# EAGLE design ArduinoWeatherStation (EAGLE 9.4.2)
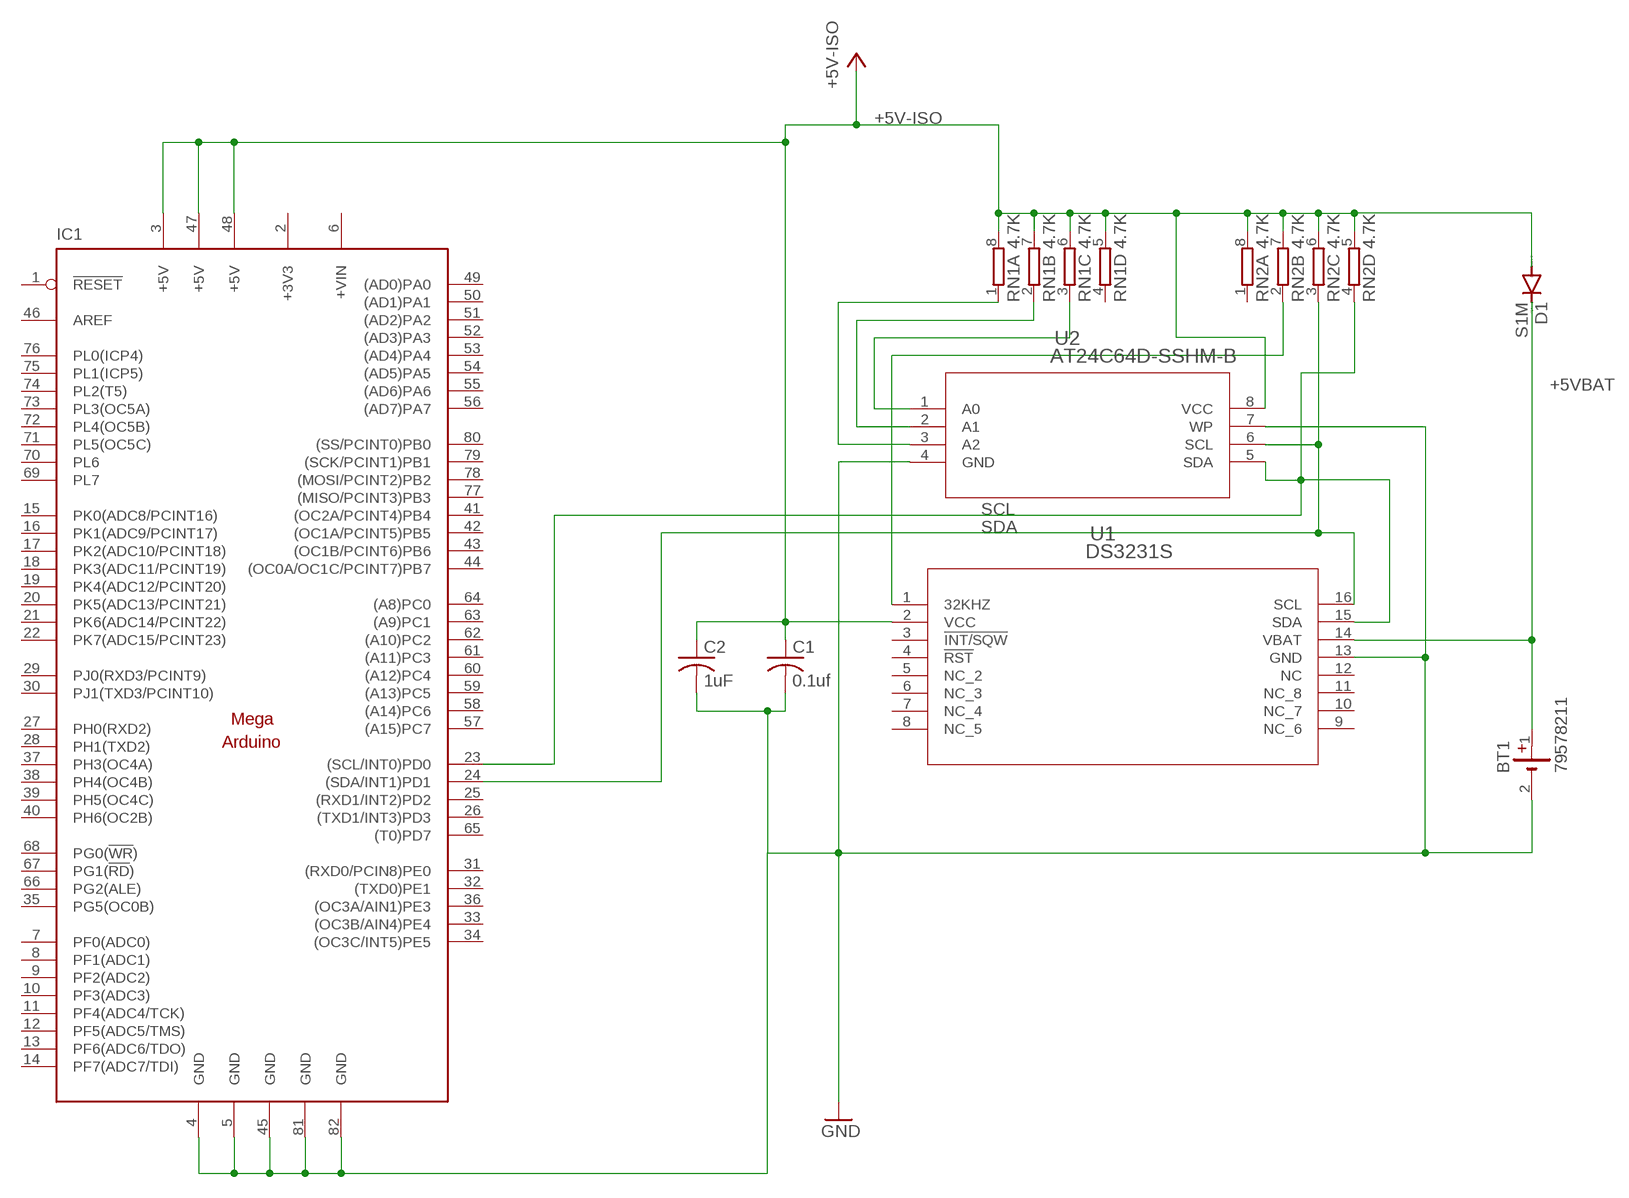
[diagram p0: schematic, sheet 1]

## Parts
BT1  79578211  [79578211]
C1  0.1uf  C-USC0603  [C0603]
C2  1uF  C-USC0603  [C0603]
D1  S1M  [SMA]
IC1  MEGAARDUINO_1  [MEGA_ARDUINO]
RN1  4.7K  4R-N0603-ARC  [0603-ARC]
RN2  4.7K  4R-N0603-ARC  [0603-ARC]
U1  DS3231S  [21-0042B_16]
U2  AT24C64D-SSHM-B  [8S1]

## Nets
+5V-ISO: C1.1 C2.1 D1.A IC1.3(+5V) IC1.47(+5V) IC1.48(+5V) RN1.5 RN1.6 RN1.7 RN1.8 RN2.5 RN2.6 RN2.7 RN2.8 U1.2(VCC) U2.8(VCC)
+5VBAT: BT1.1(+) D1.C U1.14(VBAT)
GND-ISO: BT1.2(-) C1.2 C2.2 IC1.4(GND) IC1.5(GND) IC1.45(GND) IC1.81(GND) IC1.82(GND) U1.13(GND) U2.4(GND) U2.7(WP) ; supply symbol labelled GND
N$1: RN2.2 U1.1(32KHZ)
N$3: RN1.3 U2.1(A0)
N$4: RN1.2 U2.2(A1)
N$5: RN1.1 U2.3(A2)
SCL: IC1.23((SCL/INT0)PD0) RN2.4 U1.15(SDA) U2.5(SDA)
SDA: IC1.24((SDA/INT1)PD1) RN2.3 U1.16(SCL) U2.6(SCL)
Unconnected: IC1.1(!RESET) IC1.7(PF0(ADC0)) IC1.8(PF1(ADC1)) IC1.9(PF2(ADC2)) IC1.10(PF3(ADC3)) IC1.11(PF4(ADC4/TCK)) IC1.12(PF5(ADC5/TMS)) IC1.13(PF6(ADC6/TDO)) IC1.14(PF7(ADC7/TDI)) IC1.15(PK0(ADC8/PCINT16)) IC1.16(PK1(ADC9/PCINT17)) IC1.17(PK2(ADC10/PCINT18)) IC1.18(PK3(ADC11/PCINT19)) IC1.19(PK4(ADC12/PCINT20)) IC1.20(PK5(ADC13/PCINT21)) IC1.21(PK6(ADC14/PCINT22)) IC1.22(PK7(ADC15/PCINT23)) IC1.25((RXD1/INT2)PD2) IC1.26((TXD1/INT3)PD3) IC1.27(PH0(RXD2)) IC1.28(PH1(TXD2)) IC1.29(PJ0(RXD3/PCINT9)) IC1.30(PJ1(TXD3/PCINT10)) IC1.31((RXD0/PCIN8)PE0) IC1.32((TXD0)PE1) IC1.33((OC3B/AIN4)PE4) IC1.34((OC3C/INT5)PE5) IC1.35(PG5(OC0B)) IC1.36((OC3A/AIN1)PE3) IC1.37(PH3(OC4A)) IC1.38(PH4(OC4B)) IC1.39(PH5(OC4C)) IC1.40(PH6(OC2B)) IC1.41((OC2A/PCINT4)PB4) IC1.42((OC1A/PCINT5)PB5) IC1.43((OC1B/PCINT6)PB6) IC1.44((OC0A/OC1C/PCINT7)PB7) IC1.46(AREF) IC1.49((AD0)PA0) IC1.50((AD1)PA1) IC1.51((AD2)PA2) IC1.52((AD3)PA3) IC1.53((AD4)PA4) IC1.54((AD5)PA5) IC1.55((AD6)PA6) IC1.56((AD7)PA7) IC1.57((A15)PC7) IC1.58((A14)PC6) IC1.59((A13)PC5) IC1.60((A12)PC4) IC1.61((A11)PC3) IC1.62((A10)PC2) IC1.63((A9)PC1) IC1.64((A8)PC0) IC1.65((T0)PD7) IC1.66(PG2(ALE)) IC1.67(PG1(!RD!)) IC1.68(PG0(!WR!)) IC1.69(PL7) IC1.70(PL6) IC1.71(PL5(OC5C)) IC1.72(PL4(OC5B)) IC1.73(PL3(OC5A)) IC1.74(PL2(T5)) IC1.75(PL1(ICP5)) IC1.76(PL0(ICP4)) IC1.77((MISO/PCINT3)PB3) IC1.78((MOSI/PCINT2)PB2) IC1.79((SCK/PCINT1)PB1) IC1.80((SS/PCINT0)PB0) RN1.4 RN2.1 U1.3(!INT/SQW) U1.4(!RST) U1.5(NC_2) U1.6(NC_3) U1.7(NC_4) U1.8(NC_5) U1.9(NC_6) U1.10(NC_7) U1.11(NC_8) U1.12(NC)

## Power pins joined to a net without a drawn wire
+3V3: IC1.2(+3V3)
+VIN: IC1.6(+VIN)

## Library data of the parts
BT1 = Battery Holder:79578211: BATTERY HOLDER COIN PC PIN Manufacturer's datasheet <https://katalog.we-online.de/em/datasheet/79578211.pdf>; CREATED_BY: PCBLayout.com; DIGIKEY_PART_NO: 732-12330-ND; MANUFACTURER: Wurth Electronics Inc.; MPN: 79578211
C1 C2 = rcl:C-US: CAPACITOR, American symbol; SPICEPREFIX: C
D1 = diode:S1M
IC1 = arduino:MEGAARDUINO_1: The Arduino Mega is a microcontroller board based on the ATmega1280. - 54 digital input/output pins (of which 14 can be used as PWM outputs) - 16 analog inputs - 4 UARTs (hardware serial ports) - 16 MHz crystal oscillator - USB connection - power jack - ICSP header - reset button It contains everything needed to support the microcontroller; simply connect it to a computer with a USB cable or power it with a AC-to-DC adapter or battery to get started. The Mega is compatible with most shields designed for the Arduino Duemilanove or Diecimila. http://arduino.cc/en/Main/ArduinoBoardMega
RN1 RN2 = resistor-dil:4R-N: Array Chip Resistor Source: RS Component / Phycomp; OC_FARNELL: unknown; OC_NEWARK: unknown
U1 = maxim:DS3231S; MANUFACTURER_PART_NUMBER: DS3231S; VENDOR: Maxim Integrated Products
U2 = atreml-eprom:AT24C64D-SSHM-B; MANUFACTURER_PART_NUMBER: AT24C64DSSHMB; VENDOR: Atmel

## Board
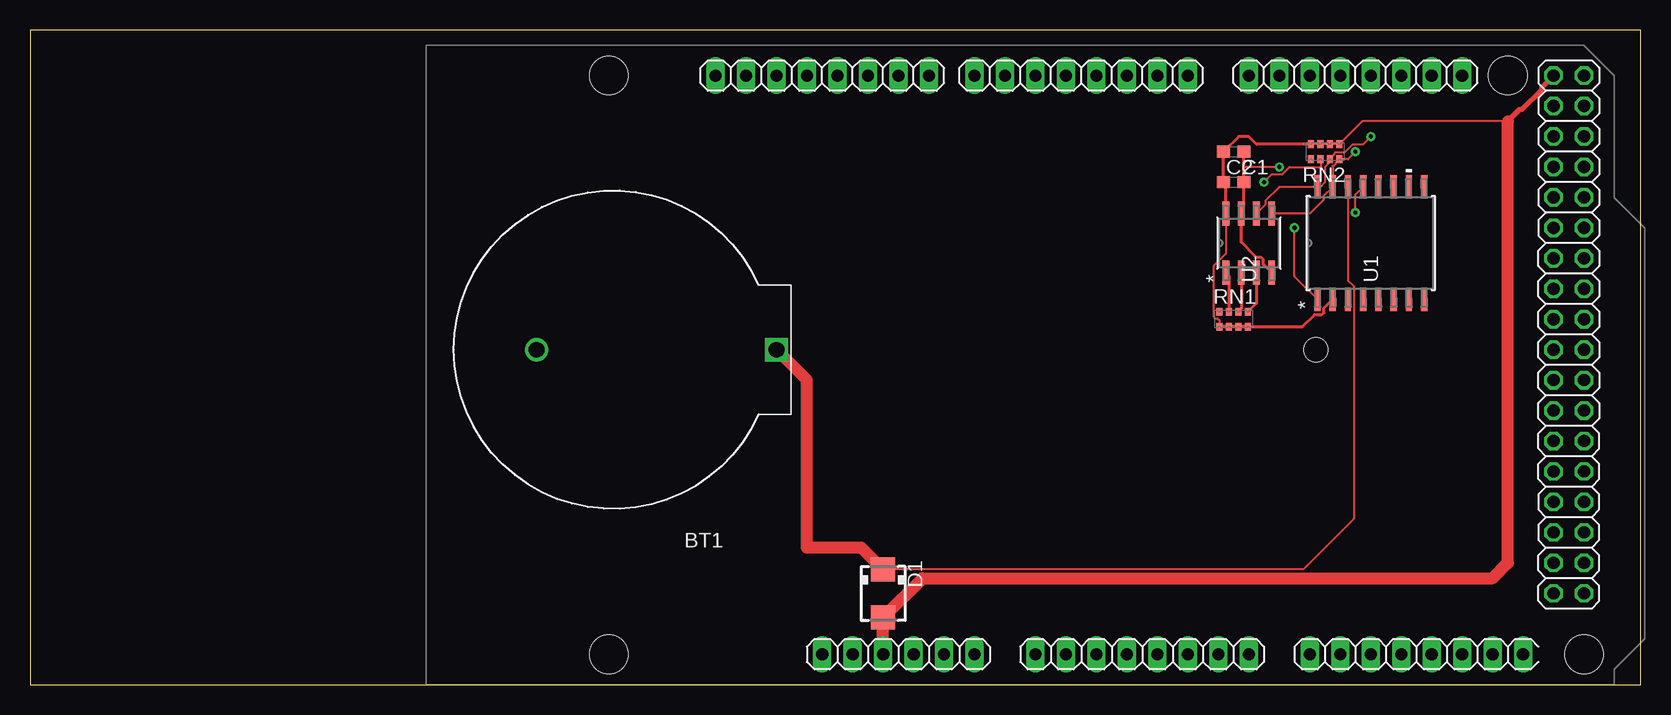
[diagram p1: board, top side]
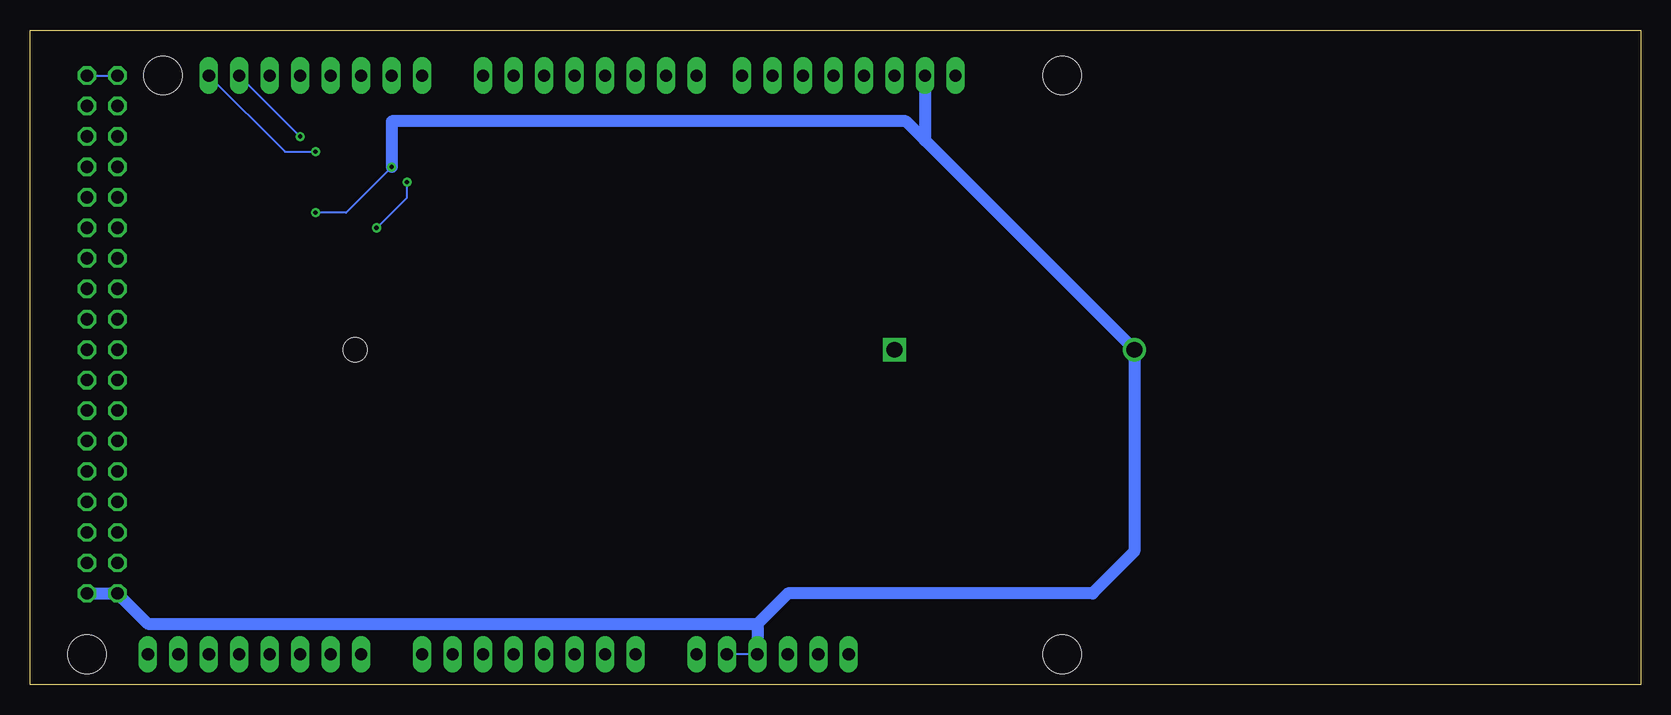
[diagram p2: board, bottom side, seen from below]

Size 134.29 x 54.6 mm. Coordinates in mm from the lower left corner, seen from the top.
Outline: 0,0 134.29,0 134.29,54.6 0,54.6 0,0
Copper layers (1*16): Top 0.035mm / dielectric 1.5mm / Bottom 0.035mm
Design rules "default": minimum track width 6mil, minimum drill 0.35mm, track to track 6mil, track to pad 6mil, pad to pad 6mil, via to via 6mil, smd to smd 6mil, copper to edge 40mil, drill to drill 6mil, minimum pad ring 10mil, minimum via ring 8mil, stop-mask expansion 4mil, vias tented up to drill 0mil, thermal gap 10mil

### Footprints (pad centres in the part's own frame; a part is rotated, then mirrored left to right if it is on the bottom)
79578211 = drill 1.3 square: 1 0,0 | drill 1.3: 2 20,0
C0603 = smd 1.1 x 1: 1 -0.85,0; 2 0.85,0
SMA = smd 2 x 2: A 2,0; C -2,0
MEGA_ARDUINO = drill 1.016 long: 1 33.02,2.54; 2 35.56,2.54; 3 38.1,2.54; 4 40.64,2.54; 5 43.18,2.54; 6 45.72,2.54; 7 50.8,2.54; 8 53.34,2.54; 9 55.88,2.54; 10 58.42,2.54; 11 60.96,2.54; 12 63.5,2.54; 13 66.04,2.54; 14 68.58,2.54; 15 73.66,2.54; 16 76.2,2.54; 17 78.74,2.54; 18 81.28,2.54; 19 83.82,2.54; 20 86.36,2.54; 21 88.9,2.54; 22 91.44,2.54; 23 86.36,50.8; 24 83.82,50.8; 25 81.28,50.8; 26 78.74,50.8; 27 76.2,50.8; 28 73.66,50.8; 29 71.12,50.8; 30 68.58,50.8; 31 63.5,50.8; 32 60.96,50.8; 33 58.42,50.8; 34 55.88,50.8; 35 53.34,50.8; 36 50.8,50.8; 37 48.26,50.8; 38 45.72,50.8; 39 41.91,50.8; 40 39.37,50.8; 41 36.83,50.8; 42 34.29,50.8; 43 31.75,50.8; 44 29.21,50.8; 45 26.67,50.8; 46 24.13,50.8 | drill 1.016 octagon: 47 93.98,50.8; 48 96.52,50.8; 49 93.98,48.26; 50 96.52,48.26; 51 93.98,45.72; 52 96.52,45.72; 53 93.98,43.18; 54 96.52,43.18; 55 93.98,40.64; 56 96.52,40.64; 57 93.98,38.1; 58 96.52,38.1; 59 93.98,35.56; 60 96.52,35.56; 61 93.98,33.02; 62 96.52,33.02; 63 93.98,30.48; 64 96.52,30.48; 65 93.98,27.94; 66 96.52,27.94; 67 93.98,25.4; 68 96.52,25.4; 69 93.98,22.86; 70 96.52,22.86; 71 93.98,20.32; 72 96.52,20.32; 73 93.98,17.78; 74 96.52,17.78; 75 93.98,15.24; 76 96.52,15.24; 77 93.98,12.7; 78 96.52,12.7; 79 93.98,10.16; 80 96.52,10.16; 81 93.98,7.62; 82 96.52,7.62 | hole 3.2: 15.24,50.8; 15.24,2.54; 90.17,50.8; 96.52,2.54 | hole 2: 74.168,27.94
0603-ARC = smd 0.5 x 0.65: 1 -1.2,-0.625; 2 -0.4,-0.625; 3 0.4,-0.625; 4 1.2,-0.625; 5 1.2,0.625; 6 0.4,0.625; 7 -0.4,0.625; 8 -1.2,0.625
21-0042B_16 = smd 1.981 x 0.533: 1 -4.686,4.445; 2 -4.686,3.175; 3 -4.686,1.905; 4 -4.686,0.635; 5 -4.686,-0.635; 6 -4.686,-1.905; 7 -4.686,-3.175; 8 -4.686,-4.445; 9 4.686,-4.445; 10 4.686,-3.175; 11 4.686,-1.905; 12 4.686,-0.635; 13 4.686,0.635; 14 4.686,1.905; 15 4.686,3.175; 16 4.686,4.445
8S1 = smd 1.981 x 0.561: 1 -2.465,1.905; 2 -2.465,0.635; 3 -2.465,-0.635; 4 -2.465,-1.905; 5 2.465,-1.905; 6 2.465,-0.635; 7 2.465,0.635; 8 2.465,1.905

### Placement (x,y rotation side)
BT1  62.23,27.94 180 top
C1  100.33,44.45 0 top
C2  100.33,41.91 0 top
D1  71.12,7.62 270 top
IC1  33.02,0 0 top
RN1  100.33,30.48 180 top
RN2  107.95,44.45 0 top
U1  111.76,36.83 90 top
U2  101.6,36.83 90 top

### Tracks (layer width: path | path; a pad name or v marks a point on that pad's centre or on a via)
+5V-ISO
  Top 0.152: RN2.8 RN2.7 RN2.6 RN2.5 111.06,46.99 123.19,46.99 | U2.8 99.69,35.96 98.65,34.92 98.65,30.68 98.78,30.55 98.99,30.55 99.13,30.41 RN1.5
  Top 0.254: RN2.8 102.25,45.08 101.6,45.72 100.75,45.72 C1.1 C2.1 99.69,41.7 U2.8 | RN1.5 RN1.6 RN1.7 RN1.8 106.07,29.86 107.09,30.87 107.7,30.87 107.86,31.04 107.86,31.42 U1.2
  Top 0.406: 123.19,46.99 124.18,47.98 124.36,47.98 126.01,49.63 126.01,49.81 IC1.47
  Top 1.016: IC1.3 D1.A 74.39,8.89 121.92,8.89 123.19,10.16 123.19,46.99
  Bottom 0.152: IC1.48 IC1.47
+5VBAT
  Top 0.152: U1.14 109.86,33.72 110.35,33.23 110.35,13.83 106.15,9.63 74.08,9.63 74.08,9.62 D1.C
  Top 1.016: D1.C 69.31,11.43 64.77,11.43 64.77,25.4 BT1.1
GND-ISO  (via drill 0.35)
  Top 0.152: v104.14,43.18 101.18,43.18 | v110.49,39.37 110.49,40.88 U1.13
  Top 0.254: C1.2 101.18,43.18 C2.2 101.18,39.51 U2.7 100.97,36.91 102.23,35.63 102.63,35.63 102.8,35.47 102.8,35.08 U2.4
  Bottom 0.152: v104.14,43.18 107.95,39.37 v110.49,39.37 | IC1.4 IC1.5
  Bottom 1.016: 59.69,45.4 BT1.2 42.23,11.11 45.72,7.62 71.12,7.62 73.66,5.08 | IC1.45 59.69,45.4 | 73.66,5.08 IC1.4 | 59.69,45.4 61.28,46.99 104.14,46.99 v104.14,43.18 | IC1.82 IC1.81 124.46,5.08 73.66,5.08
N$1  (via drill 0.35)
  Top 0.152: U1.1 105.41,34.05 v105.41,38.1 | v102.87,41.91 103.53,42.57 104.39,42.57 105,43.18 107.64,43.18 107.64,43.73 RN2.2
  Bottom 0.152: v105.41,38.1 102.87,40.64 v102.87,41.91
N$3
  Top 0.254: U2.1 99.93,34.13 RN1.3
N$4
  Top 0.254: U2.2 100.97,31.34 RN1.2
N$5
  Top 0.254: U2.3 102.23,31.81 RN1.1
SCL  (via drill 0.35)
  Top 0.152: v110.49,44.45 109.86,43.83 RN2.4 108.83,43.5 108.83,43.41 108.69,43.27 108.6,43.27 108.58,43.26 U1.15 107.81,40.74 107.81,40.43 106.67,39.3 U2.5
  Bottom 0.152: IC1.23 113.03,44.45 v110.49,44.45
SDA  (via drill 0.35)
  Top 0.152: v111.76,45.72 111.1,45.06 110.24,45.06 109.56,44.38 108.81,44.38 108.67,44.24 108.67,44.15 RN2.3 108.35,43.58 107.95,43.18 107.95,41.91 107.56,41.52 U1.16 104.13,41.52 103,40.38 103,40.06 U2.6
  Bottom 0.152: IC1.24 v111.76,45.72